# Altium schematic sheet ANT_Miner_CtrlUnit_V1.2.SchDoc: ANT_Miner_CtrlBoard_V1.2
size A3; Date: 2013/11/29; DrawnBy: Bitmain Technology; SheetNumber: 1; SheetTotal: 1
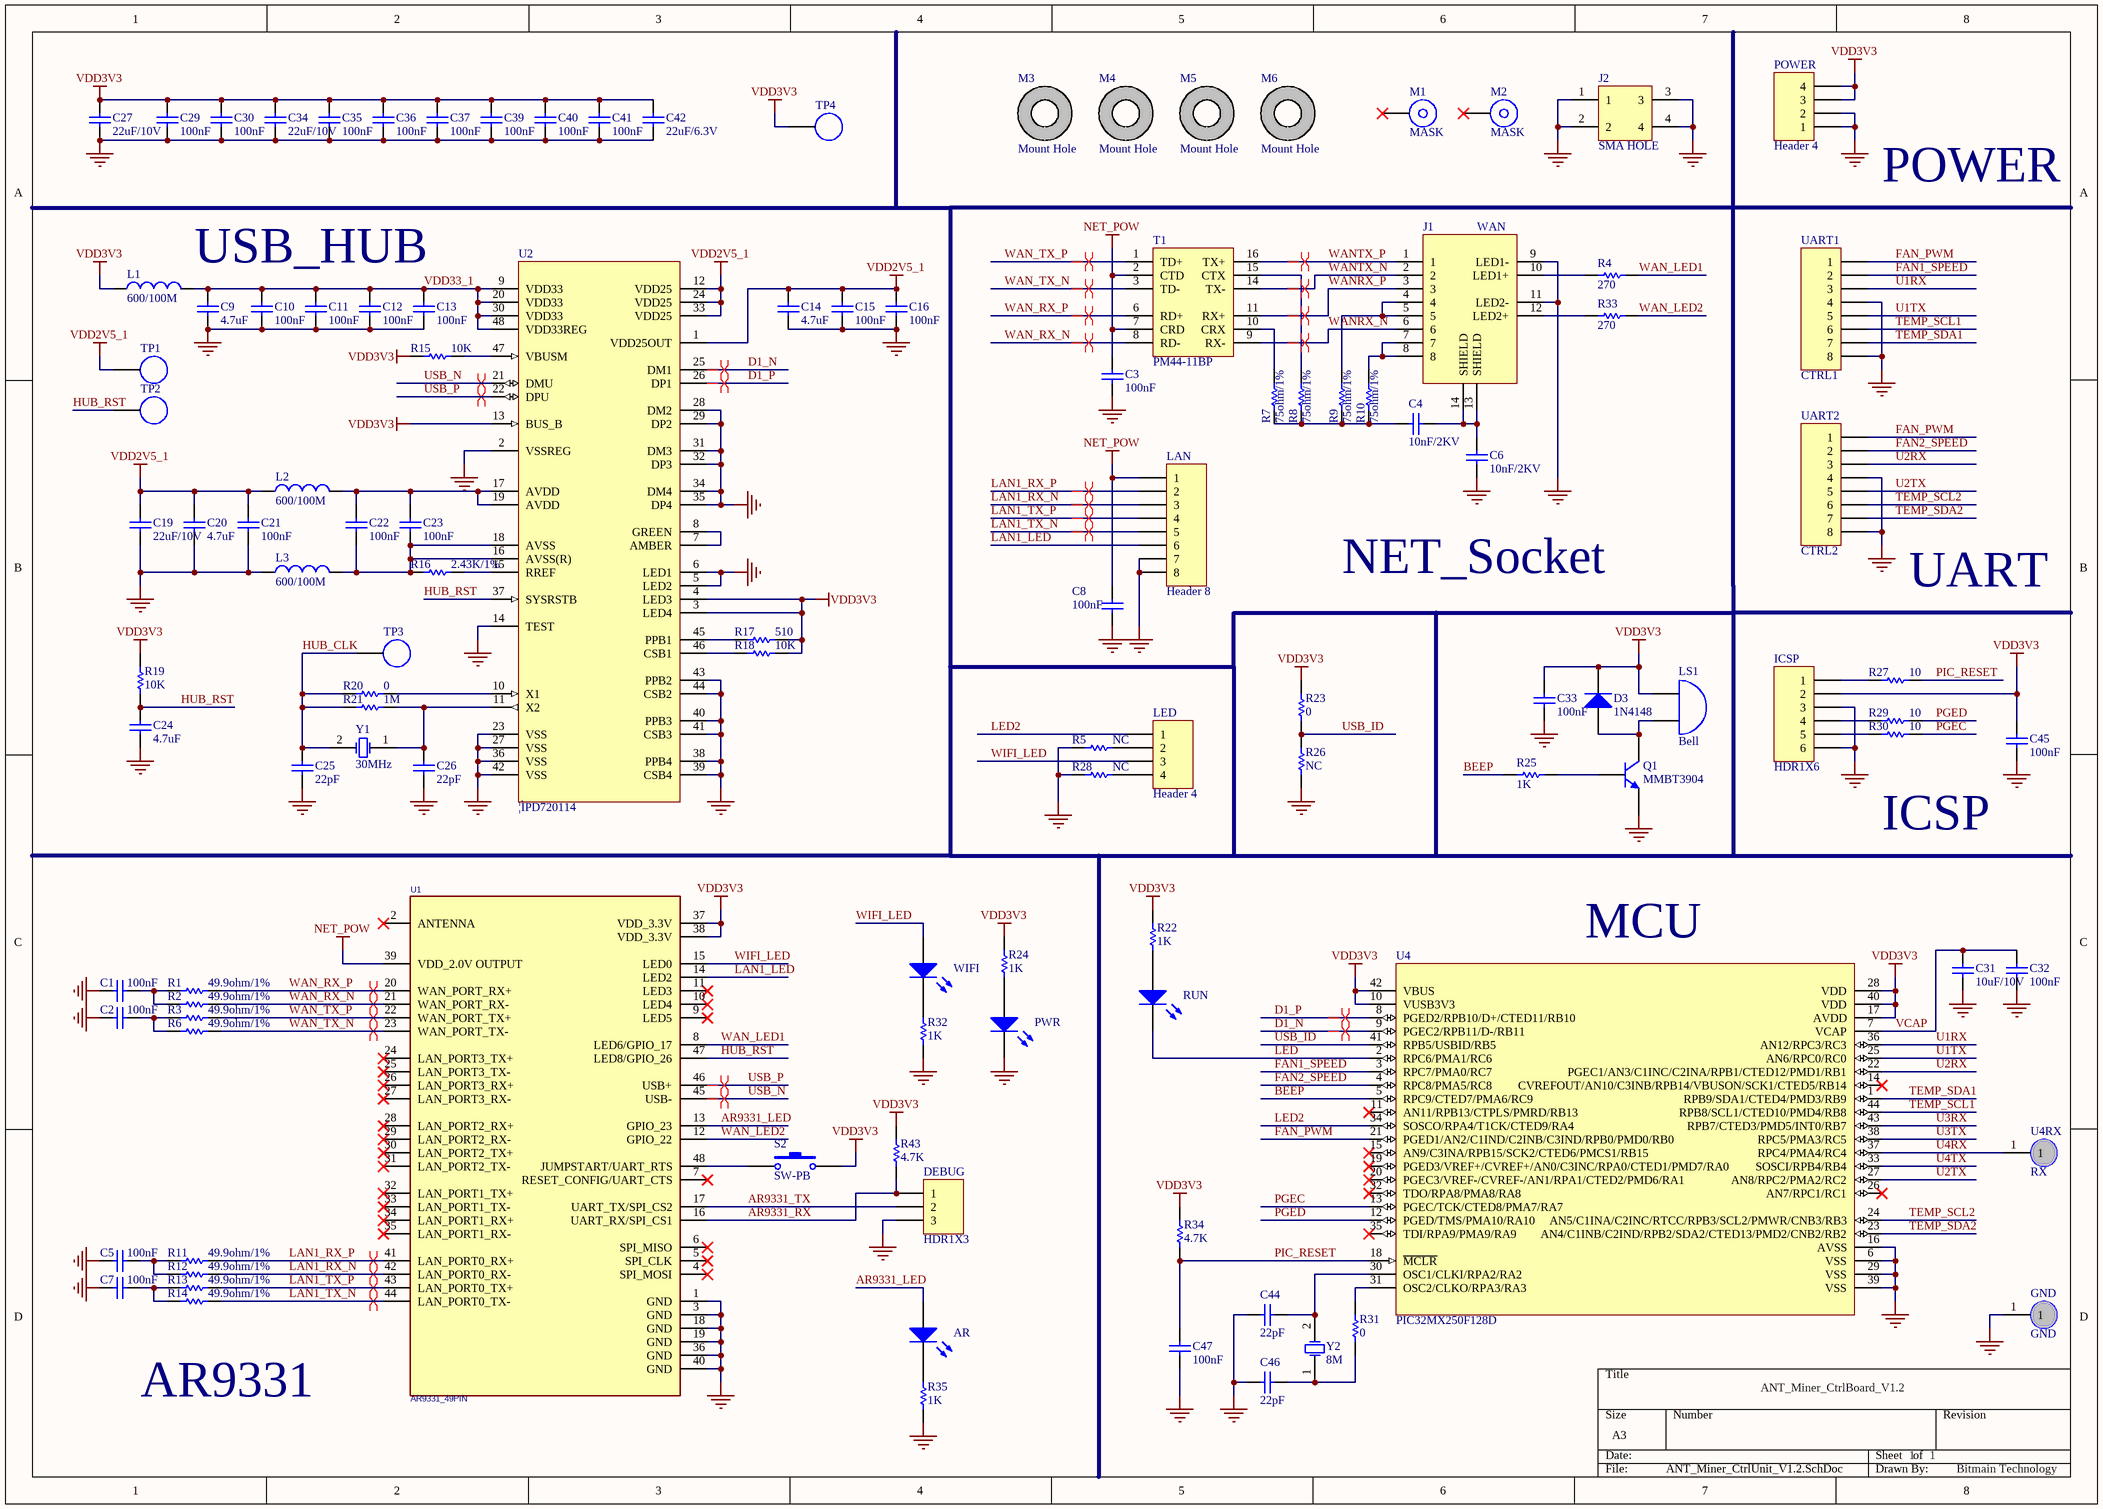
[diagram p0: ANT_Miner_CtrlUnit_V1.2.SchDoc]

## Parts
AR  Green  [LED0603(1608)]  (value not drawn)
C1  100nF  [CC0603(1608)]
C2  100nF  [CC0603(1608)]
C3  100nF  [CC0603(1608)]
C4  10nF/2KV  [1812]
C5  100nF  [CC0603(1608)]
C6  10nF/2KV  [1812]
C7  100nF  [CC0603(1608)]
C8  100nF  [CC0603(1608)]
C9  4.7uF  [CC0603(1608)]
C10  100nF  [CC0603(1608)]
C11  100nF  [CC0603(1608)]
C12  100nF  [CC0603(1608)]
C13  100nF  [CC0603(1608)]
C14  4.7uF  [CC0603(1608)]
C15  100nF  [CC0603(1608)]
C16  100nF  [CC0603(1608)]
C19  22uF/10V  [CC1210(3225)]
C20  4.7uF  [CC0603(1608)]
C21  100nF  [CC0603(1608)]
C22  100nF  [CC0603(1608)]
C23  100nF  [CC0603(1608)]
C24  4.7uF  [CC0603(1608)]
C25  22pF  [CC0603(1608)]
C26  22pF  [CC0603(1608)]
C27  22uF/10V  [CC1210(3225)]
C29  100nF  [CC0603(1608)]
C30  100nF  [CC0603(1608)]
C31  10uF/10V  [CC1210(3225)]
C32  100nF  [CC0603(1608)]
C33  100nF  [CC0603(1608)]
C34  22uF/10V  [CC1210(3225)]
C35  100nF  [CC0603(1608)]
C36  100nF  [CC0603(1608)]
C37  100nF  [CC0603(1608)]
C39  100nF  [CC0603(1608)]
C40  100nF  [CC0603(1608)]
C41  100nF  [CC0603(1608)]
C42  22uF/6.3V  [CC1210(3225)]
C44  22pF  [CC0603(1608)]
C45  100nF  [CC0603(1608)]
C46  22pF  [CC0603(1608)]
C47  100nF  [CC0603(1608)]
D3  1N4148  [DIODE0805]
DEBUG  HDR1X3  [HDR1X3]
GND  GND  [TP_DIP_1.5mm]
ICSP  HDR1X6  [HDR1X6]
J1  WAN  [RJ45_2LED_DIP]
J2  SMA HOLE  [SMA_HOLE]
L1  600/100M  [INDC1608L]
L2  600/100M  [INDC1608L]
L3  600/100M  [INDC1608L]
LAN  Header 8  [8Pin_180]
LED  Header 4  [4Pin_180]
LS1  Bell  [YR5025A]
M1  MASK  [MASK]
M2  MASK  [MASK]
M3  Mount Hole  [HOLE_3.2]
M4  Mount Hole  [HOLE_3.2]
M5  Mount Hole  [HOLE_3.2]
M6  Mount Hole  [HOLE_3.2]
POWER  Header 4  [4Pin_180]
PWR  Red  [LED0603(1608)]  (value not drawn)
Q1  MMBT3904  [SOT23_L]
R1  49.9ohm/1%  [RR0603(1608)]
R2  49.9ohm/1%  [RR0603(1608)]
R3  49.9ohm/1%  [RR0603(1608)]
R4  270  [RR0603(1608)]
R5  NC  [RR0603(1608)]
R6  49.9ohm/1%  [RR0603(1608)]
R7  75ohm/1%  [RR0603(1608)]
R8  75ohm/1%  [RR0603(1608)]
R9  75ohm/1%  [RR0603(1608)]
R10  75ohm/1%  [RR0603(1608)]
R11  49.9ohm/1%  [RR0603(1608)]
R12  49.9ohm/1%  [RR0603(1608)]
R13  49.9ohm/1%  [RR0603(1608)]
R14  49.9ohm/1%  [RR0603(1608)]
R15  10K  [RR0603(1608)]
R16  2.43K/1%  [RR0603(1608)]
R17  510  [RR0603(1608)]
R18  10K  [RR0603(1608)]
R19  10K  [RR0603(1608)]
R20  0  [RR0603(1608)]
R21  1M  [RR0603(1608)]
R22  1K  [RR0603(1608)]
R23  0  [RR0603(1608)]
R24  1K  [RR0603(1608)]
R25  1K  [RR0603(1608)]
R26  NC  [RR0603(1608)]
R27  10  [RR0603(1608)]
R28  NC  [RR0603(1608)]
R29  10  [RR0603(1608)]
R30  10  [RR0603(1608)]
R31  0  [RR0603(1608)]
R32  1K  [RR0603(1608)]
R33  270  [RR0603(1608)]
R34  4.7K  [RR0603(1608)]
R35  1K  [RR0603(1608)]
R43  4.7K  [RR0603(1608)]
RUN  Green  [LED0603(1608)]  (value not drawn)
S2  SW-PB  [SWITCH_3x4]
T1  PM44-11BP  [PM44-11BP]
TP1  TP  [TP2]  (value not drawn)
TP2  TP  [TP2]  (value not drawn)
TP3  TP  [TP2]  (value not drawn)
TP4  TP  [TP2]  (value not drawn)
U1  AR9331_49PIN  [AR9331_49PIN]
U2  ¦ÌPD720114  [TQFP48_L]
U4  PIC32MX250F128D  [TQFP44_L]
U4RX  RX  [TP_DIP_1.5mm]
UART1  CTRL1  [8Pin_180]
UART2  CTRL2  [8Pin_180]
WIFI  Green  [LED0603(1608)]  (value not drawn)
Y1  30MHz  [4SMX]
Y2  8M  [4SMX]

## Nets
GND: C1.2 C2.2 C3.2 C5.2 C6.2 C7.2 C8.2 C9.1 C10.1 C11.1 C12.1 C13.1 C14.1 C15.1 C16.1 C19.1 C20.1 C21.1 C24.1 C25.1 C26.1 C27.1 C29.1 C30.1 C31.1 C32.1 C33.1 C34.1 C35.1 C36.1 C37.1 C39.1 C40.1 C41.1 C42.1 C44.1 C45.1 C46.1 C47.1 DEBUG.3 GND.1 ICSP.3 ICSP.6 J1.9(LED1-) J1.11(LED2-) J2.1 J2.2 J2.3 J2.4 L3.1 LAN.7 LAN.8 POWER.1 POWER.2 PWR.2(K) Q1.2(E) R5.2 R26.1 R28.2 R32.1 R35.1 U1.1(GND) U1.3(GND) U1.18(GND) U1.19(GND) U1.36(GND) U1.40(GND) U2.2(VSSREG) U2.5(LED2) U2.6(LED1) U2.14(TEST) U2.23(VSS) U2.27(VSS) U2.28(DM2) U2.29(DP2) U2.31(DM3) U2.32(DP3) U2.34(DM4) U2.35(DP4) U2.36(VSS) U2.38(PPB4) U2.39(CSB4) U2.40(PPB3) U2.41(CSB3) U2.42(VSS) U2.43(PPB2) U2.44(CSB2) U4.6(VSS) U4.16(AVSS) U4.29(VSS) U4.39(VSS) UART1.4 UART1.8 UART2.4 UART2.8
NET_POW: C3.1 C8.1 LAN.1 T1.2(CTD) T1.7(CRD) U1.39(VDD_2.0V_OUTPUT)
VDD2V5_1: C14.2 C15.2 C16.2 C19.2 C20.2 C21.2 L2.1 TP1.1 U2.1(VDD25OUT) U2.12(VDD25) U2.24(VDD25) U2.33(VDD25)
VDD3V3: C27.2 C29.2 C30.2 C33.2 C34.2 C35.2 C36.2 C37.2 C39.2 C40.2 C41.2 C42.2 C45.2 D3.2(K) ICSP.2 L1.1 LS1.1(A) POWER.3 POWER.4 R15.1 R17.2 R18.2 R19.2 R22.2 R23.2 R24.2 R34.2 R43.2 S2.2 TP4.1 U1.37(VDD_3.3V) U1.38(VDD_3.3V) U2.3(LED4) U2.4(LED3) U2.13(BUS_B) U4.10(VUSB3V3) U4.17(AVDD) U4.28(VDD) U4.40(VDD) U4.42(VBUS)
AR9331_LED: AR.1(A) U1.13(GPIO_23)
AR9331_RX: DEBUG.1 R43.1 U1.16(UART_RX/SPI_CS1)
AR9331_TX: DEBUG.2 U1.17(UART_TX/SPI_CS2)
BEEP: R25.2 U4.5(RPC9/CTED7/PMA6/RC9)
D1_N: U2.25(DM1) U4.9(PGEC2/RPB11/D-/RB11)
D1_P: U2.26(DP1) U4.8(PGED2/RPB10/D+/CTED11/RB10)
FAN1_SPEED: U4.3(RPC7/PMA0/RC7) UART1.2
FAN2_SPEED: U4.4(RPC8/PMA5/RC8) UART2.2
FAN_PWM: U4.21(PGED1/AN2/C1IND/C2INB/C3IND/RPB0/PMD0/RB0) UART1.1 UART2.1
HUB_CLK: C25.2 R20.2 R21.2 TP3.1 Y1.2(OSC2)
HUB_RST: C24.2 R19.1 TP2.1 U1.47(LED8/GPIO_26) U2.37(SYSRSTB)
LAN1_LED: LAN.6 U1.14(LED2)
LAN1_RX_N: LAN.3 R12.2 U1.42(LAN_PORT0_RX-)
LAN1_RX_P: LAN.2 R11.2 U1.41(LAN_PORT0_RX+)
LAN1_TX_N: LAN.5 R14.2 U1.44(LAN_PORT0_TX-)
LAN1_TX_P: LAN.4 R13.2 U1.43(LAN_PORT0_TX+)
LED: RUN.2(K) U4.2(RPC6/PMA1/RC6)
LED2: LED.1 U4.34(SOSCO/RPA4/T1CK/CTED9/RA4)
PGEC: R30.1 U4.13(PGEC/TCK/CTED8/PMA7/RA7)
PGED: R29.1 U4.12(PGED/TMS/PMA10/RA10)
PIC_RESET: C47.2 R27.1 R34.1 U4.18(~{MCLR})
TEMP_SCL1: U4.44(RPB8/SCL1/CTED10/PMD4/RB8) UART1.6
TEMP_SCL2: U4.24(AN5/C1INA/C2INC/RTCC/RPB3/SCL2/PMWR/CNB3/RB3) UART2.6
TEMP_SDA1: U4.1(RPB9/SDA1/CTED4/PMD3/RB9) UART1.7
TEMP_SDA2: U4.23(AN4/C1INB/C2IND/RPB2/SDA2/CTED13/PMD2/CNB2/RB2) UART2.7
U1RX: U4.36(AN12/RPC3/RC3) UART1.3
U1TX: U4.25(AN6/RPC0/RC0) UART1.5
U2RX: U4.22(PGEC1/AN3/C1INC/C2INA/RPB1/CTED12/PMD1/RB1) UART2.3
U2TX: U4.27(AN8/RPC2/PMA2/RC2) UART2.5
U3RX: U4.43(RPB7/CTED3/PMD5/INT0/RB7)
U3TX: U4.38(RPC5/PMA3/RC5)
U4RX: U4.37(RPC4/PMA4/RC4) U4RX.1
U4TX: U4.33(SOSCI/RPB4/RB4)
USB_ID: R23.1 R26.2 U4.41(RPB5/USBID/RB5)
USB_N: U1.45(USB-) U2.21(DMU)
USB_P: U1.46(USB+) U2.22(DPU)
VCAP: C31.2 C32.2 U4.7(VCAP)
VDD33_1: C9.2 C10.2 C11.2 C12.2 C13.2 L1.2 U2.9(VDD33) U2.20(VDD33) U2.30(VDD33) U2.48(VDD33REG)
WAN_LED1: R4.1 U1.8(LED6/GPIO_17)
WAN_LED2: R33.1 U1.12(GPIO_22)
WAN_RX_N: R2.2 T1.8(RD-) U1.21(WAN_PORT_RX-)
WAN_RX_P: R1.2 T1.6(RD+) U1.20(WAN_PORT_RX+)
WAN_TX_N: R6.2 T1.3(TD-) U1.23(WAN_PORT_TX-)
WAN_TX_P: R3.2 T1.1(TD+) U1.22(WAN_PORT_TX+)
WANRX_N: J1.6 T1.9(RX-)
WANRX_P: J1.3 T1.11(RX+)
WANTX_N: J1.2 T1.14(TX-)
WANTX_P: J1.1 T1.16(TX+)
WIFI_LED: LED.3 U1.15(LED0) WIFI.1(A)
NetAR_2: AR.2(K) R35.2
NetC1_1: C1.1 R1.1 R2.1
NetC2_1: C2.1 R3.1 R6.1
NetC4_1: C4.1 C6.1 J1.13(SHIELD) J1.14(SHIELD)
NetC4_2: C4.2 R7.2 R8.2 R9.2 R10.2
NetC5_1: C5.1 R11.1 R12.1
NetC7_1: C7.1 R13.1 R14.1
NetC22_1: C22.1 C23.1 L3.2 R16.1 U2.16(AVSS(R)) U2.18(AVSS)
NetC22_2: C22.2 C23.2 L2.2 U2.17(AVDD) U2.19(AVDD)
NetC26_2: C26.2 R21.1 U2.11(X2) Y1.1(OSC1)
NetC44_2: C44.2 U4.30(OSC1/CLKI/RPA2/RA2) Y2.2(OSC2)
NetC46_2: C46.2 R31.1 Y2.1(OSC1)
NetD3_1: D3.1(A) LS1.2(B) Q1.3(C)
NetICSP_1: ICSP.1 R27.2
NetICSP_4: ICSP.4 R29.2
NetICSP_5: ICSP.5 R30.2
NetJ1_4: J1.4 J1.5 R9.1
NetJ1_7: J1.7 J1.8 R10.1
NetJ1_10: J1.10(LED1+) R4.2
NetJ1_12: J1.12(LED2+) R33.2
NetLED_2: LED.2 R5.1
NetLED_4: LED.4 R28.1
NetPWR_1: PWR.1(A) R24.1
NetQ1_1: Q1.1(B) R25.1
NetR7_1: R7.1 T1.10(CRX)
NetR8_1: R8.1 T1.15(CTX)
NetR15_2: R15.2 U2.47(VBUSM)
NetR16_2: R16.2 U2.15(RREF)
NetR17_1: R17.1 U2.45(PPB1)
NetR18_1: R18.1 U2.46(CSB1)
NetR20_1: R20.1 U2.10(X1)
NetR22_1: R22.1 RUN.1(A)
NetR31_2: R31.2 U4.31(OSC2/CLKO/RPA3/RA3)
NetR32_2: R32.2 WIFI.2(K)
NetS2_1: S2.1 U1.48(JUMPSTART/UART_RTS)
NetU2_7: U2.7(AMBER) U2.8(GREEN)

Not connected (* = marked no-connect by the designer): M1 1*; M2 1*; M3 0(PIN); M4 0(PIN); M5 0(PIN); M6 0(PIN); U1 2(ANTENNA)* 4(SPI_MOSI)* 5(SPI_CLK)* 6(SPI_MISO)* 7(RESET_CONFIG/UART_CTS)* 9(LED5)* 10(LED4)* 11(LED3)* 24(LAN_PORT3_TX+)* 25(LAN_PORT3_TX-)* 26(LAN_PORT3_RX+)* 27(LAN_PORT3_RX-)* 28(LAN_PORT2_RX+)* 29(LAN_PORT2_RX-)* 30(LAN_PORT2_TX+)* 31(LAN_PORT2_TX-)* 32(LAN_PORT1_TX+)* 33(LAN_PORT1_TX-)* 34(LAN_PORT1_RX+)* 35(LAN_PORT1_RX-)*; U4 11(AN11/RPB13/CTPLS/PMRD/RB13)* 14(CVREFOUT/AN10/C3INB/RPB14/VBUSON/SCK1/CTED5/RB14)* 15(AN9/C3INA/RPB15/SCK2/CTED6/PMCS1/RB15)* 19(PGED3/VREF+/CVREF+/AN0/C3INC/RPA0/CTED1/PMD7/RA0)* 20(PGEC3/VREF-/CVREF-/AN1/RPA1/CTED2/PMD6/RA1)* 26(AN7/RPC1/RC1)* 32(TDO/RPA8/PMA8/RA8)* 35(TDI/RPA9/PMA9/RA9)*

## Layout directives
differential pair: D1_N, D1_P, LAN1_RX_N, LAN1_RX_P, LAN1_TX_N, LAN1_TX_P, USB_N, USB_P, WAN_RX_N, WAN_RX_P, WAN_TX_N, WAN_TX_P, WANRX_N, WANRX_P, WANTX_N, WANTX_P

## Notes on the sheet
- POWER
- USB_HUB
- NET_Socket
- UART
- ICSP
- (near U4) MCU
- AR9331

## Library data of the parts
AR PWR RUN WIFI = LED0: Typical INFRARED GaAs LED; Published: 8-Jun-2000; LatestRevisionDate: 08-Jul-2005; LatestRevisionNote: Mech Layer 1 removed.; PackageReference: LED-0; Publisher: Altium Limited; PackageDescription: LED; 2 Leads
  AR RUN WIFI: value: Green
  PWR: value: Red
C1-C16 C19-C27 C29-C37 C39-C42 C44-C47 = Cap Semi: Capacitor (Semiconductor SIM Model); Published: 8-Jun-2000; LatestRevisionDate: 29-May-2009; LatestRevisionNote: IPC-7351 Footprint Added.; PackageReference: C1206; Publisher: Altium Limited; PackageDescription: Chip Capacitor
  C1-C3 C5 C7 C8 C10-C13 C15 C16 C21-C23 C29 C30 C32 C33 C35-C37 C39-C41 C45 C47: Value: 100nF
  C4 C6: Value: 10nF/2KV
  C9 C14 C20 C24: Value: 4.7uF
  C19 C27 C34: Value: 22uF/10V
  C25 C26 C44 C46: Value: 22pF
  C31: Value: 10uF/10V
  C42: Value: 22uF/6.3V
D3 = Diode 1N4148: High Conductance Fast Diode; Published: 8-Jun-2000; LatestRevisionDate: 17-Jul-2002; LatestRevisionNote: Re-released for DXP Platform.; DatasheetVersion: 1997; PackageReference: DO-35; Publisher: Altium Limited; PackageDescription: Diode, Axial; Body 3.8 x 1.9 mm (LxDia. max), Lead Dia. 0.53 mm (max); Code_JEDEC: DO-204-AH; ComponentLink1Description: Manufacturer Link; ComponentLink1URL: http://www.fairchildsemi.com/; ComponentLink2Description: Datasheet; ComponentLink2URL: http://www.fairchildsemi.com/ds/1N%2F1N4148.pdf
DEBUG = Header 3: Header, 3-Pin; LatestRevisionDate: 17-Jul-2002; LatestRevisionNote: Re-released for DXP Platform.; Publisher: Altium Limited
GND U4RX = TP
ICSP = Header 6: Header, 6-Pin; LatestRevisionDate: 17-Jul-2002; LatestRevisionNote: Re-released for DXP Platform.; Publisher: Altium Limited
J1 = RJ45-DIP: RJ45,DUAL LED,DIP
J2 = SMA_HOLE: SMA Socket Assembly Hole.
L1-L3 = Inductor: Code_IEC: 1005; Published: 8-Jun-2000; LatestRevisionDate: 29-May-2009; LatestRevisionNote: IPC-7351 Footprint Added.; PackageReference: 0402-A; Publisher: Altium Limited; PackageDescription: Chip Inductor; Code_JEITA: 0402; Value: 600/100M
LAN UART1 UART2 = Header 8: Header, 8-Pin; LatestRevisionDate: 17-Jul-2002; LatestRevisionNote: Re-released for DXP Platform.; Publisher: Altium Limited
LED POWER = Header 4: Header, 4-Pin; LatestRevisionDate: 17-Jul-2002; LatestRevisionNote: Re-released for DXP Platform.; Publisher: Altium Limited
LS1 = Bell: Electrical Bell; Published: 24-Mar-1999; LatestRevisionDate: 17-Jul-2002; LatestRevisionNote: Re-released for DXP Platform.; PackageReference: PIN2; Publisher: Altium Limited
M3-M6 = M_Hole
Q1 = MMBT3904: NPN Switching Transistor; Published: 17-Sep-2003; LatestRevisionDate: 12-Dec-2006; LatestRevisionNote: IPC-7351 Footprint Added.; DatasheetVersion: 13-May-2002; PackageVersion: May-1999; PackageReference: SOT23; Publisher: Altium Limited; PackageDescription: 3-Pin SOT-23 Package 0.95 mm Pitch, 2.3 mm Lead Span; ComponentLink1Description: Manufacturer Link; ComponentLink1URL: http://www.semiconductors.philips.com/; ComponentLink2Description: Datasheet; ComponentLink2URL: http://www.semiconductors.philips.com/acrobat/datasheets/MMBT3904_4.pdf
R1-R35 R43 = Res1: Resistor
  R1-R3 R6 R11-R14: Value: 49.9ohm/1%
  R4 R33: Value: 270
  R5 R28: Value: NC
  R7-R10: Published: 8-Jun-2000; LatestRevisionDate: 17-Jul-2002; LatestRevisionNote: Re-released for DXP Platform.; PackageReference: AXIAL-0.3; Publisher: Altium Limited; PackageDescription: Axial Device, Thru-Hole; 2 Leads; 0.3 in Pin Spacing; Value: 75ohm/1%
  R15 R18 R19: Value: 10K
  R16: Value: 2.43K/1%
  R17: Value: 510
  R20: Value: 0
  R21: Value: 1M
  R22 R25: Published: 8-Jun-2000; LatestRevisionDate: 17-Jul-2002; LatestRevisionNote: Re-released for DXP Platform.; PackageReference: AXIAL-0.3; Publisher: Altium Limited; PackageDescription: Axial Device, Thru-Hole; 2 Leads; 0.3 in Pin Spacing; Value: 1K
  R23 R31: Published: 8-Jun-2000; LatestRevisionDate: 17-Jul-2002; LatestRevisionNote: Re-released for DXP Platform.; PackageReference: AXIAL-0.3; Publisher: Altium Limited; PackageDescription: Axial Device, Thru-Hole; 2 Leads; 0.3 in Pin Spacing; Value: 0
  R24 R32 R35: Value: 1K
  R26: Published: 8-Jun-2000; LatestRevisionDate: 17-Jul-2002; LatestRevisionNote: Re-released for DXP Platform.; PackageReference: AXIAL-0.3; Publisher: Altium Limited; PackageDescription: Axial Device, Thru-Hole; 2 Leads; 0.3 in Pin Spacing; Value: NC
  R27 R29 R30: Published: 8-Jun-2000; LatestRevisionDate: 17-Jul-2002; LatestRevisionNote: Re-released for DXP Platform.; PackageReference: AXIAL-0.3; Publisher: Altium Limited; PackageDescription: Axial Device, Thru-Hole; 2 Leads; 0.3 in Pin Spacing; Value: 10
  R34 R43: Published: 8-Jun-2000; LatestRevisionDate: 17-Jul-2002; LatestRevisionNote: Re-released for DXP Platform.; PackageReference: AXIAL-0.3; Publisher: Altium Limited; PackageDescription: Axial Device, Thru-Hole; 2 Leads; 0.3 in Pin Spacing; Value: 4.7K
S2 = SW-PB: Switch; Published: 24-Mar-1999; LatestRevisionDate: 17-Jul-2002; LatestRevisionNote: Re-released for DXP Platform.; PackageReference: SPST-2; Publisher: Altium Limited; PackageDescription: Switch; 2 Leads
TP1-TP4 = TP2
U2 = uPD720114
Y1 Y2 = XTAL: Crystal Oscillator; Published: 8-Jun-2000; LatestRevisionDate: 17-Jul-2002; LatestRevisionNote: Re-released for DXP Platform.; PackageReference: R38; Publisher: Altium Limited; PackageDescription: Crystal, Thru-Hole; 2 Leads; Body 3.1 x 8.2 mm (Dia.xH)